# EAGLE design FPC_40pin0p8mm (EAGLE 9.6.2)
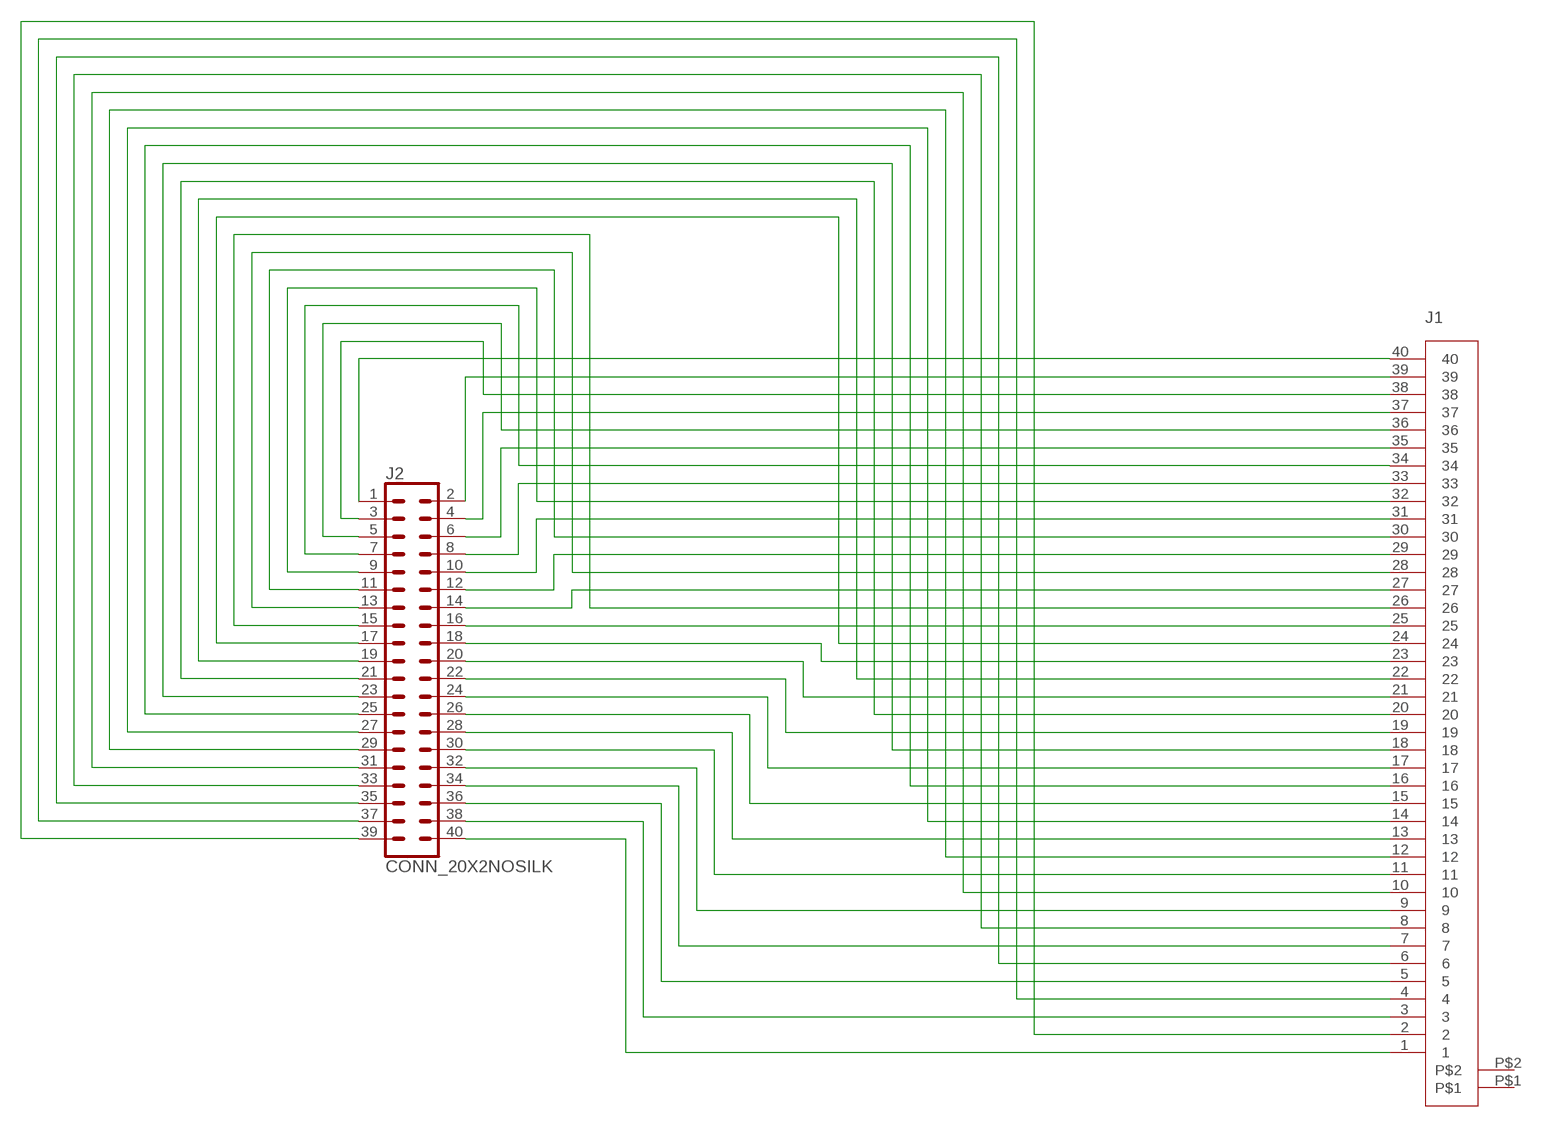
[diagram p0: schematic, sheet 1]

## Parts
J1  FPC40_P8MM  [FPC40_P8MM]
J2  CONN_20X2NOSILK  [2X20_NOSILK]

## Nets
N$1: J1.40 J2.1
N$2: J1.39 J2.2
N$3: J1.38 J2.3
N$4: J1.37 J2.4
N$5: J1.36 J2.5
N$6: J1.35 J2.6
N$7: J1.34 J2.7
N$8: J1.33 J2.8
N$9: J1.32 J2.9
N$10: J1.31 J2.10
N$11: J1.30 J2.11
N$12: J1.29 J2.12
N$13: J1.28 J2.13
N$14: J1.27 J2.14
N$15: J1.26 J2.15
N$16: J1.25 J2.16
N$17: J1.24 J2.17
N$18: J1.23 J2.18
N$19: J1.22 J2.19
N$20: J1.21 J2.20
N$21: J1.20 J2.21
N$22: J1.19 J2.22
N$23: J1.18 J2.23
N$24: J1.17 J2.24
N$25: J1.16 J2.25
N$26: J1.15 J2.26
N$27: J1.14 J2.27
N$28: J1.13 J2.28
N$29: J1.12 J2.29
N$30: J1.11 J2.30
N$31: J1.10 J2.31
N$32: J1.9 J2.32
N$33: J1.8 J2.33
N$34: J1.6 J2.35
N$35: J1.4 J2.37
N$36: J1.2 J2.39
N$37: J1.7 J2.34
N$38: J1.5 J2.36
N$39: J1.3 J2.38
N$40: J1.1 J2.40
Unconnected: J1.P$1 J1.P$2

## Library data of the parts
J1 = FPC40_p8mm:FPC40_P8MM: Molex Right Angle FPC Connector 1mm pitch, bottom contacts with 32 pins. Molex Part Number DigiKey Part Number
J2 = SparkFun-Connectors:CONN_20X2: Multi connection point. Often used as Generic Header-pin footprint for 0.1 inch spaced/style header connections On any of the 0.1 inch spaced packages, you can populate with these: Break Away Headers - Straight <https://www.sparkfun.com/products/116> (PRT-00116) Break Away Male Headers - Right Angle <https://www.sparkfun.com/products/553> (PRT-00553) Female Headers <https://www.sparkfun.com/products/115> (PRT-00115) Break Away Headers - Machine Pin <https://www.sparkfun.com/products/117> (PRT-00117) Break Away Female Headers - Swiss Machine Pin <https://www.sparkfun.com/products/743> (PRT-00743)

## Board
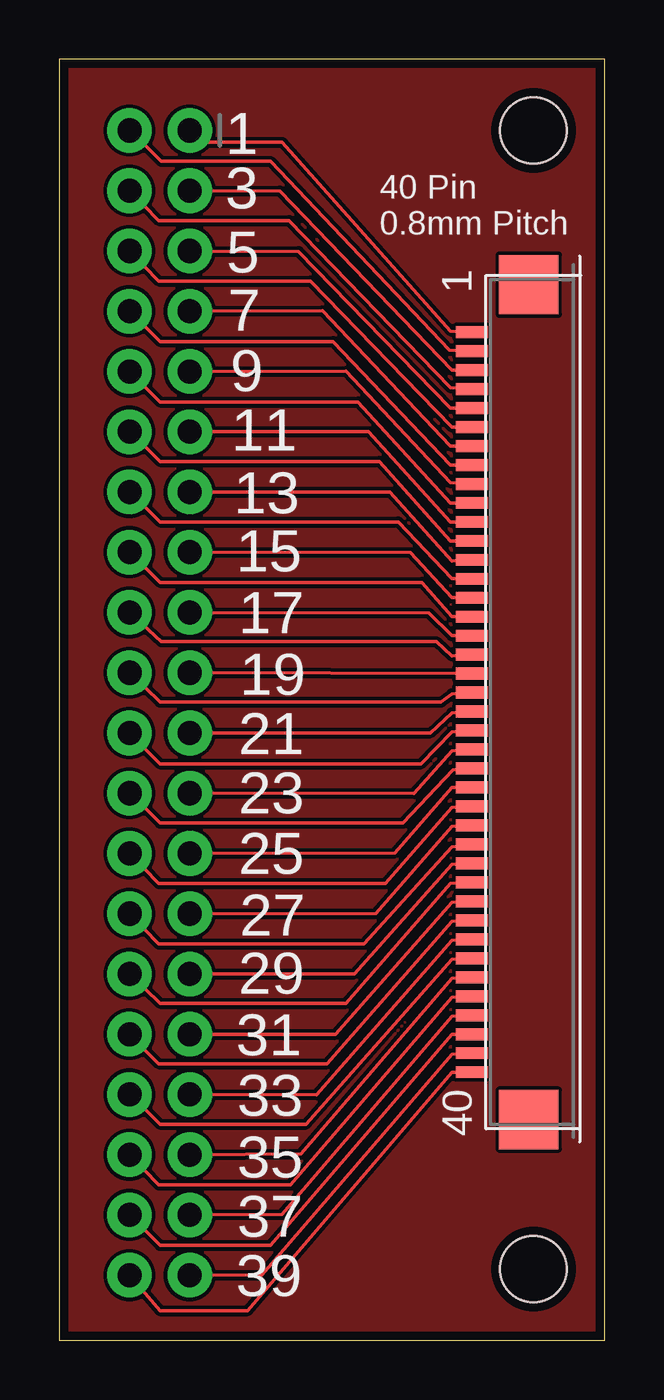
[diagram p1: board, top side]
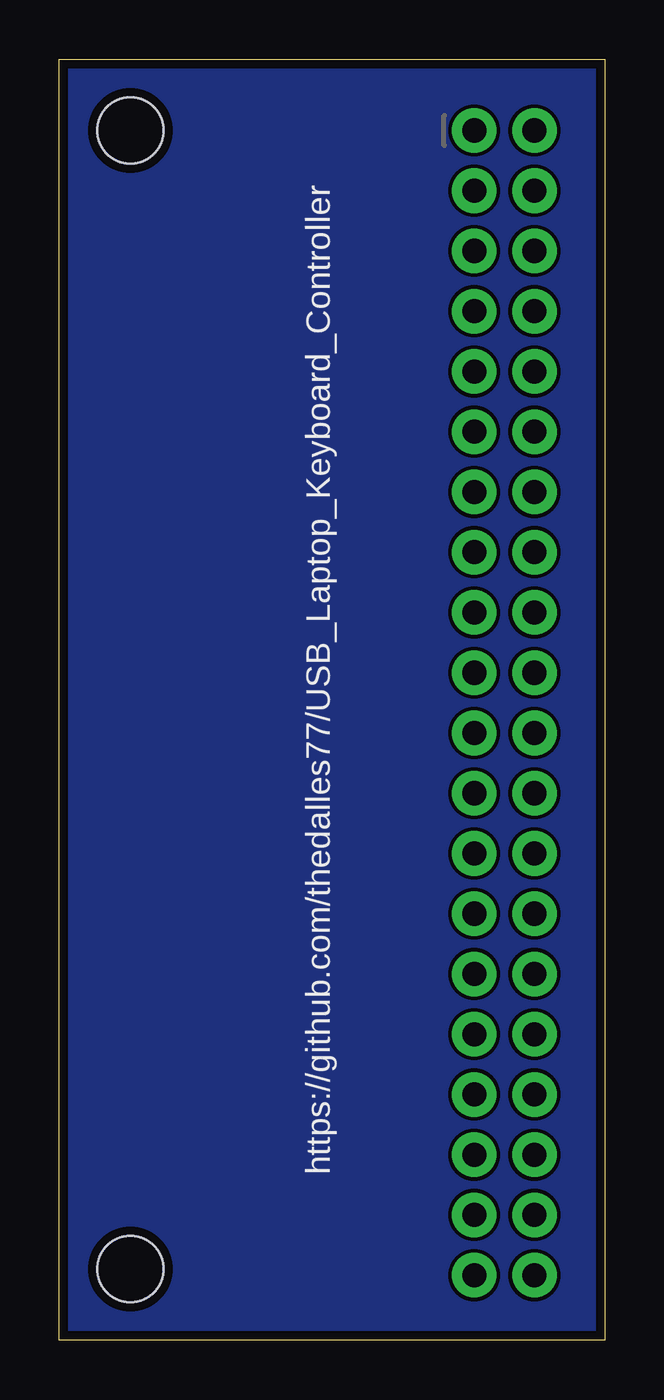
[diagram p2: board, bottom side, seen from below]

Size 23 x 54 mm. Coordinates in mm from the lower left corner, seen from the top.
Outline: 0,0 23,0 23,54 0,54 0,0
Copper layers (1*16): Top 0.035559375mm / dielectric 1.6mm / Bottom 0.035559375mm
Design rules "oshpark-2layer": minimum track width 6mil, minimum drill 10mil, track to track 6mil, track to pad 6mil, pad to pad 6mil, via to via 6mil, smd to smd 6mil, copper to edge 15mil, drill to drill 6mil, minimum pad ring 5mil, minimum via ring 5mil, stop-mask expansion 2.5mil, vias tented up to drill 0mil, thermal gap 10mil
Holes 2.8 mm at 20,51 20,3

### Footprints (pad centres in the part's own frame; a part is rotated, then mirrored left to right if it is on the bottom)
FPC40_P8MM = smd 0.5 x 1.35: 1 -13.7,3.6; 2 -12.9,3.6; 3 -12.1,3.6; 4 -11.3,3.6; 5 -10.5,3.6; 6 -9.7,3.6; 7 -8.9,3.6; 8 -8.1,3.6; 9 -7.3,3.6; 10 -6.5,3.6; 11 -5.7,3.6; 12 -4.9,3.6; 13 -4.1,3.6; 14 -3.3,3.6; 15 -2.5,3.6; 16 -1.7,3.6; 17 -0.9,3.6; 18 -0.1,3.6; 19 0.7,3.6; 20 1.5,3.6; 21 2.3,3.6; 22 3.1,3.6; 23 3.9,3.6; 24 4.7,3.6; 25 5.5,3.6; 26 6.3,3.6; 27 7.1,3.6; 28 7.9,3.6; 29 8.7,3.6; 30 9.5,3.6; 31 10.3,3.6; 32 11.1,3.6; 33 11.9,3.6; 34 12.7,3.6; 35 13.5,3.6; 36 14.3,3.6; 37 15.1,3.6; 38 15.9,3.6; 39 16.7,3.6; 40 17.5,3.6 | smd 2.5 x 2.5: P$1 -15.7,1.2; P$2 19.5,1.2
2X20_NOSILK = drill 1.016 pad 1.88: 1 0,0; 2 0,2.54; 3 2.54,0; 4 2.54,2.54; 5 5.08,0; 6 5.08,2.54; 7 7.62,0; 8 7.62,2.54; 9 10.16,0; 10 10.16,2.54; 11 12.7,0; 12 12.7,2.54; 13 15.24,0; 14 15.24,2.54; 15 17.78,0; 16 17.78,2.54; 17 20.32,0; 18 20.32,2.54; 19 22.86,0; 20 22.86,2.54; 21 25.4,0; 22 25.4,2.54; 23 27.94,0; 24 27.94,2.54; 25 30.48,0; 26 30.48,2.54; 27 33.02,0; 28 33.02,2.54; 29 35.56,0; 30 35.56,2.54; 31 38.1,0; 32 38.1,2.54; 33 40.64,0; 34 40.64,2.54; 35 43.18,0; 36 43.18,2.54; 37 45.72,0; 38 45.72,2.54; 39 48.26,0; 40 48.26,2.54

### Placement (x,y rotation side)
J1  21,25 90 top
J2  5.5,51 270 bottom

### Tracks (layer width: path | path; a pad name or v marks a point on that pad's centre or on a via)
N$1
  Top 0.152: J2.1 6,50.5 9.4,50.5 16.5,42.55 J1.40
N$2
  Top 0.152: J2.2 3,51 4.3,49.7 8.9,49.7 16.45,41.75 J1.39
N$3
  Top 0.152: J2.3 9.3,48.45 16.55,40.9 J1.38
N$4
  Top 0.152: J2.4 4.2,47.2 9.7,47.2 16.5,40.15 J1.37
N$5
  Top 0.152: J2.5 10.1,45.9 16.5,39.3 J1.36
N$6
  Top 0.152: J2.6 4.2,44.65 10.6,44.65 16.55,38.5 J1.35
N$7
  Top 0.152: J2.7 11.1,43.4 16.5,37.7 J1.34
N$8
  Top 0.152: J2.8 4.25,42.1 11.55,42.1 16.5,36.9 J1.33
N$9
  Top 0.152: J2.9 12.1,40.85 16.5,36.15 J1.32
N$10
  Top 0.152: J2.10 4.25,39.55 12.6,39.55 16.5,35.3 J1.31
N$11
  Top 0.152: J2.11 13.05,38.3 16.5,34.5 J1.30
N$12
  Top 0.152: J2.12 4.25,37.05 13.5,37.05 16.5,33.7 J1.29
N$13
  Top 0.152: J2.13 13.95,35.75 16.55,32.85 J1.28
N$14
  Top 0.152: J2.14 4.25,34.5 14.3,34.5 16.55,32.1 J1.27
N$15
  Top 0.152: J2.15 14.8,33.2 16.55,31.3 J1.26
N$16
  Top 0.152: J2.16 4.25,31.95 15.3,31.95 16.55,30.5 J1.25
N$17
  Top 0.152: J2.17 15.6,30.65 16.55,29.7 J1.24
N$18
  Top 0.152: J2.18 4.3,29.45 15.9,29.45 16.55,28.85 J1.23
N$19
  Top 0.152: J2.19 J1.22
N$20
  Top 0.152: J2.20 4.25,26.9 16.1,26.9 16.55,27.25 J1.21
N$21
  Top 0.152: J2.21 15.65,25.6 16.55,26.45 J1.20
N$22
  Top 0.152: J2.22 4.25,24.3 15.25,24.3 16.55,25.65 J1.19
N$23
  Top 0.152: J2.23 14.95,23.05 16.55,24.85 J1.18
N$24
  Top 0.152: J2.24 4.25,21.8 14.5,21.8 16.6,24.05 J1.17
N$25
  Top 0.152: J2.25 14.15,20.55 16.55,23.3 J1.16
N$26
  Top 0.152: J2.26 4.2,19.25 13.75,19.25 16.55,22.45 J1.15
N$27
  Top 0.152: J2.27 13.35,18 16.55,21.65 J1.14
N$28
  Top 0.152: J2.28 4.2,16.7 12.85,16.7 16.55,20.8 J1.13
N$29
  Top 0.152: J2.29 12.45,15.45 16.55,20.05 J1.12
N$30
  Top 0.152: J2.30 4.25,14.2 12.1,14.2 16.5,19.25 J1.11
N$31
  Top 0.152: J2.31 11.65,12.9 16.55,18.45 J1.10
N$32
  Top 0.152: J2.32 4.2,11.65 11.3,11.65 16.55,17.65 J1.9
N$33
  Top 0.152: J2.33 10.85,10.35 16.55,16.85 J1.8
N$34
  Top 0.152: J2.35 10.2,7.85 16.55,15.25 J1.6
N$35
  Top 0.152: J2.37 9.4,5.3 16.55,13.65 J1.4
N$36
  Top 0.152: J2.39 8.55,2.75 16.55,12.05 J1.2
N$37
  Top 0.152: J2.34 4.25,9.1 10.4,9.1 16.55,16.05 J1.7
N$38
  Top 0.152: J2.36 4.2,6.55 9.75,6.55 16.55,14.45 J1.5
N$39
  Top 0.152: J2.38 4.25,4 8.9,4 16.55,12.9 J1.3
N$40
  Top 0.152: J2.40 4.25,1.25 7.95,1.25 16.55,11.3 J1.1
N$41
  pour Top: 0,0 0,54 23,54 23,0
N$42
  pour Bottom: 0,0 0,54 23,54 23,0

### Text on the board
tPlace: 1 | 3 | 40 Pin / 0.8mm Pitch | 5 | 7 | 9 | 11 | 13 | 15 | 17 | 19 | 21 | 23 | 25 | 27 | 29 | 31 | 33 | 35 | 37 | 39
bPlace: https://github.com/thedalles77/USB_Laptop_Keyboard_Controller